# EAGLE design BusPirate-ultra-testboard.v1.0 (EAGLE 9.4.2)
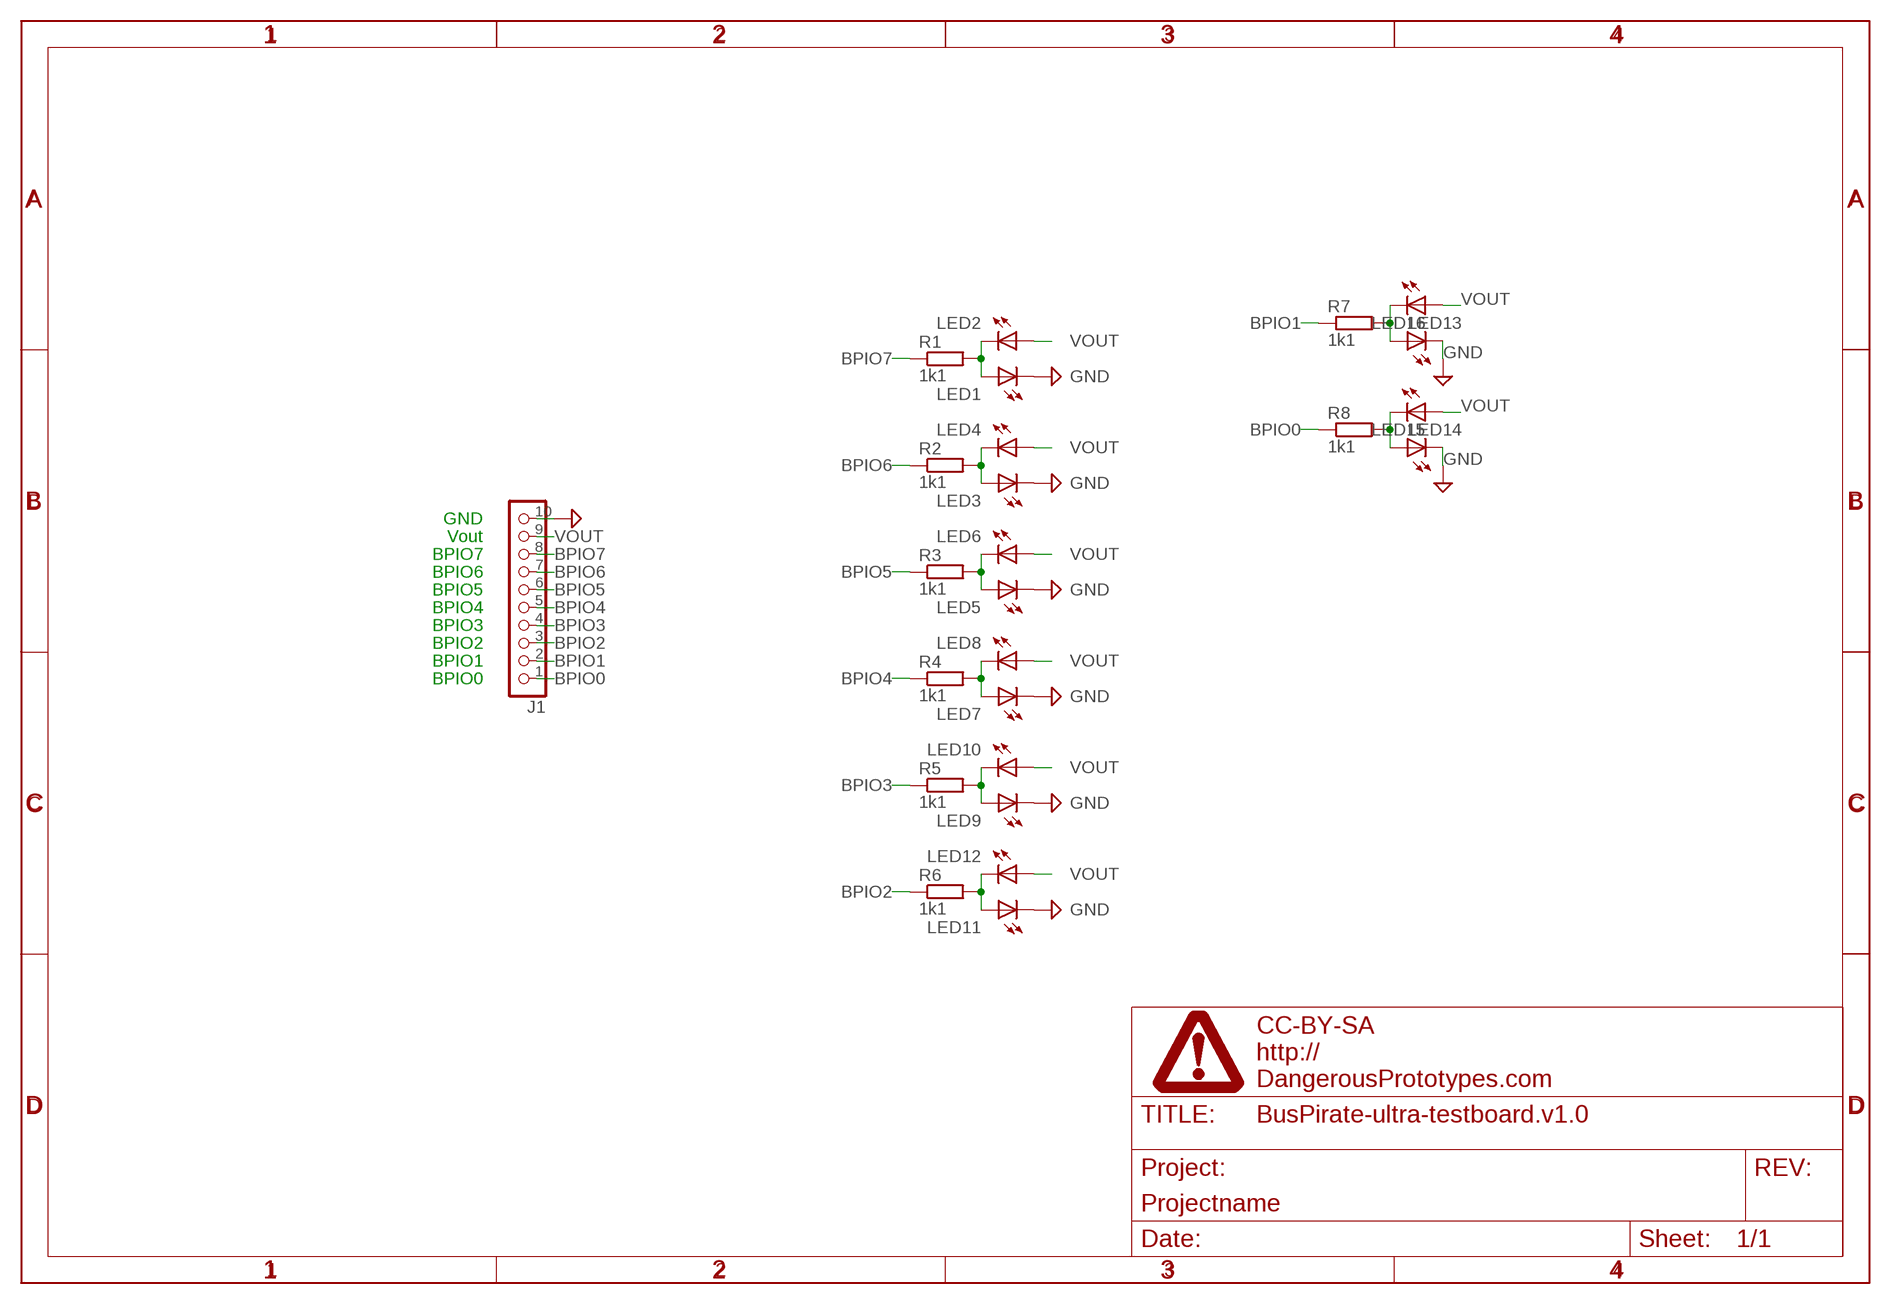
[diagram p0: schematic, sheet 1]

## Parts
J1  CON_HEADER_1X10-RIGHT_ANGLED_PTH  [M1X10_FEMALE_RIGHT_ANGLED_PTH]
LED1  LED-0805  [LED-805]
LED2  LED-0805  [LED-805]
LED3  LED-0805  [LED-805]
LED4  LED-0805  [LED-805]
LED5  LED-0805  [LED-805]
LED6  LED-0805  [LED-805]
LED7  LED-0805  [LED-805]
LED8  LED-0805  [LED-805]
LED9  LED-0805  [LED-805]
LED10  LED-0805  [LED-805]
LED11  LED-0805  [LED-805]
LED12  LED-0805  [LED-805]
LED13  LED-0805  [LED-805]
LED14  LED-0805  [LED-805]
LED15  LED-0805  [LED-805]
LED16  LED-0805  [LED-805]
PAGE1  FRAME_DINA4_L  [DP_LOGO]
R1  1k1  RESISTOR-0603  [R603]
R2  1k1  RESISTOR-0603  [R603]
R3  1k1  RESISTOR-0603  [R603]
R4  1k1  RESISTOR-0603  [R603]
R5  1k1  RESISTOR-0603  [R603]
R6  1k1  RESISTOR-0603  [R603]
R7  1k1  RESISTOR-0603  [R603]
R8  1k1  RESISTOR-0603  [R603]

## Nets
BPIO0: J1.1 R8.1
BPIO1: J1.2 R7.1
BPIO2: J1.3 R6.1
BPIO3: J1.4 R5.1
BPIO4: J1.5 R4.1
BPIO5: J1.6 R3.1
BPIO6: J1.7 R2.1
BPIO7: J1.8 R1.1
GND: J1.10 LED1.C LED3.C LED5.C LED7.C LED9.C LED11.C LED13.C LED14.C ; supply symbol labelled DGND
N$1: LED1.A LED2.C R1.2
N$2: LED3.A LED4.C R2.2
N$3: LED5.A LED6.C R3.2
N$4: LED7.A LED8.C R4.2
N$5: LED9.A LED10.C R5.2
N$6: LED11.A LED12.C R6.2
N$7: LED14.A LED15.C R8.2
N$8: LED13.A LED16.C R7.2
VOUT: J1.9 LED2.A LED4.A LED6.A LED8.A LED10.A LED12.A LED15.A LED16.A

## Notes on the sheet
- GND
- Vout
- BPIO7
- BPIO6
- BPIO5
- BPIO4
- BPIO3
- BPIO2
- BPIO1
- BPIO0

## Library data of the parts
J1 = dp_devices.v6:CON_HEADER_1X10
LED1-LED16 = dp_devices.v6:LED: Light Emitting Diode
PAGE1 = dp_devices.v6:FRAME_DINA4_L: A4 DP frame Standard Dangerous Prototypes schematic frame. Automagically adds the DP logo and standard texts to the PCB Use the atrribute in the schematic editor to change the fields.; FF1: fulfillment by; FF2: Seeed Studio; FF3: www.seeedstudio.com; LICENSE: CC-BY-SA; PROJECT: Projectname; URL1: http://; URL2: DangerousPrototypes.com
R1-R8 = dp_devices.v6:RESISTOR

## Board
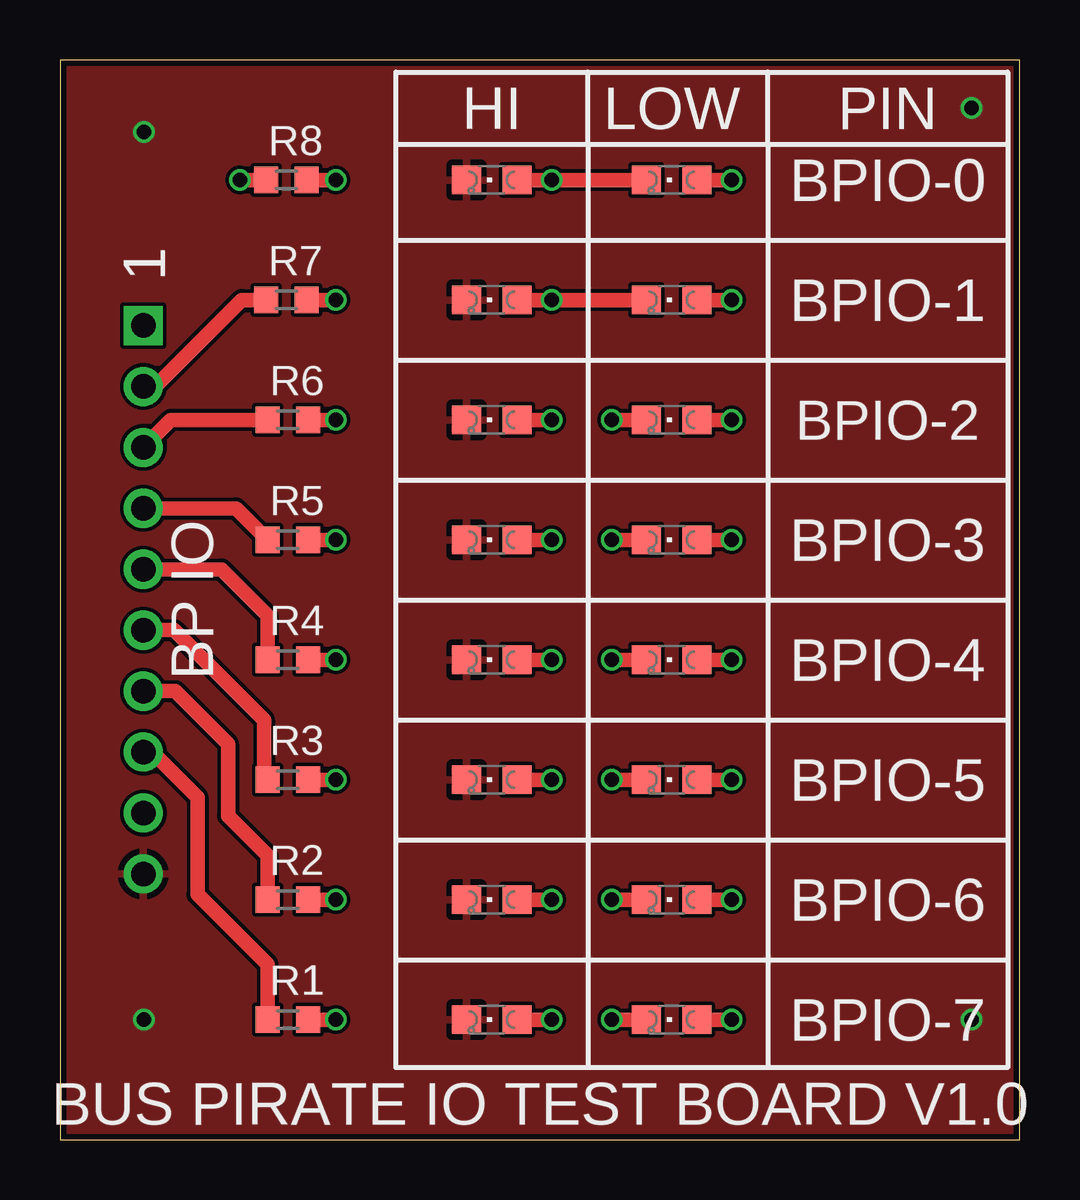
[diagram p1: board, top side]
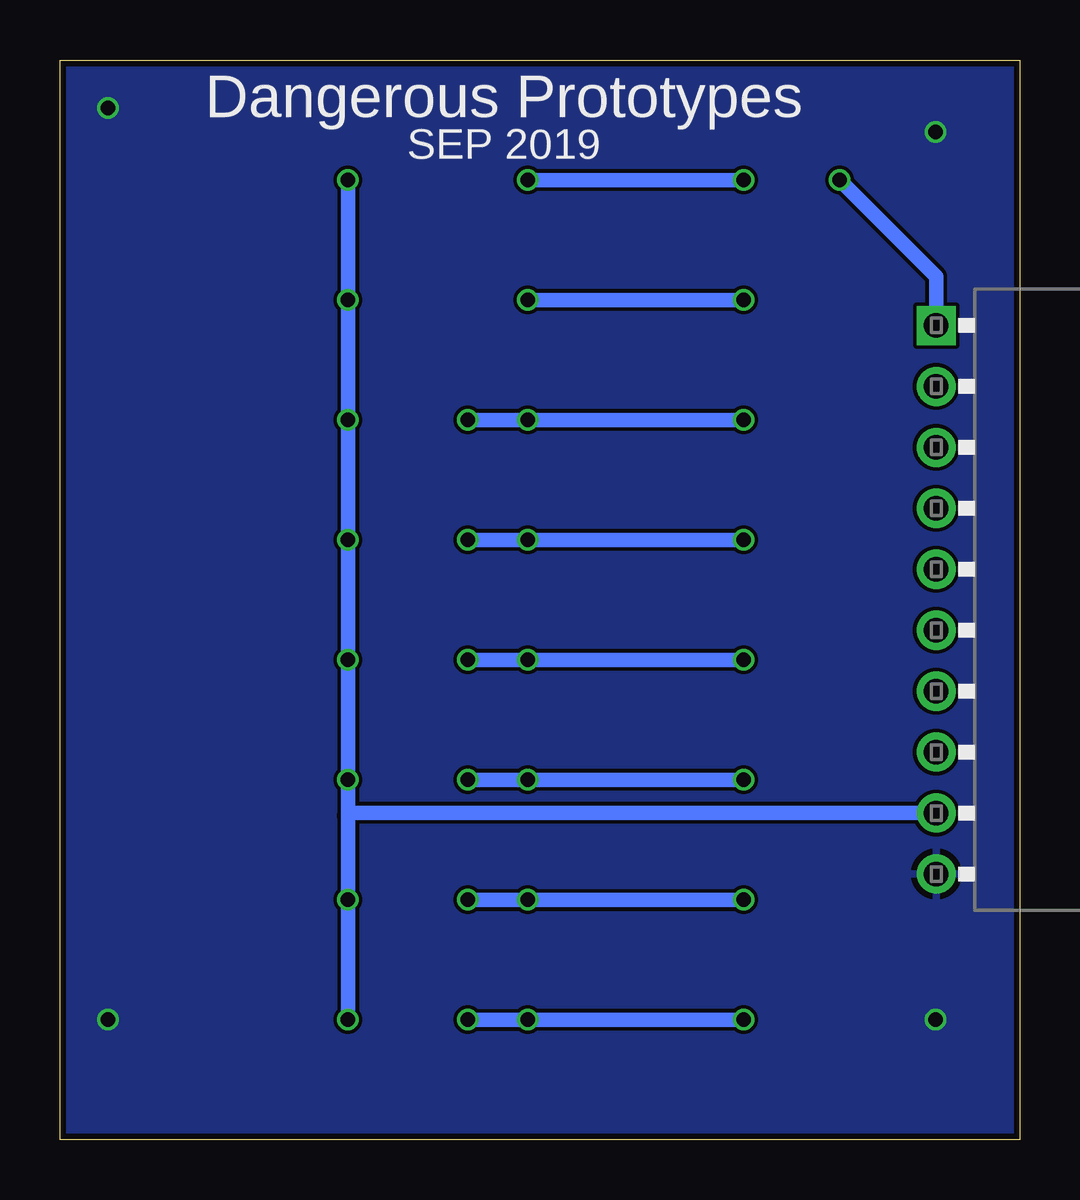
[diagram p2: board, bottom side, seen from below]

Size 40 x 45 mm. Coordinates in mm from the lower left corner, seen from the top.
Outline: 0,0 40,0 40,45 0,45 0,0
Copper layers (1*16): Top 0.035mm / dielectric 1.5mm / Bottom 0.035mm
Design rules "dirt_cheap_dirty_boards.v1.1": minimum track width 6mil, minimum drill 12mil, track to track 6mil, track to pad 6mil, pad to pad 6mil, via to via 6mil, smd to smd 0mil, copper to edge 10mil, drill to drill 10mil, minimum pad ring 10mil, minimum via ring 6mil, stop-mask expansion 2mil, vias tented up to drill 25mil, thermal gap 10mil

### Footprints (pad centres in the part's own frame; a part is rotated, then mirrored left to right if it is on the bottom)
M1X10_FEMALE_RIGHT_ANGLED_PTH = drill 1.02 pad 1.632 square: 1 -11.43,-5.85 | drill 1.02 pad 1.632: 2 -8.89,-5.85; 3 -6.35,-5.85; 4 -3.81,-5.85; 5 -1.27,-5.85; 6 1.27,-5.85; 7 3.81,-5.85; 8 6.35,-5.85; 9 8.89,-5.85; 10 11.43,-5.85
LED-805 = smd 1.2 x 1.2: A 0,-1.05; C 0,1.05
R603 = smd 1 x 1.1: 1 -0.85,0; 2 0.85,0

### Placement (x,y rotation side)
J1  -2.38,22.5 270 bottom
LED1  18,5 90 top
LED2  25.5,5 90 top
LED3  18,10 90 top
LED4  25.5,10 90 top
LED5  18,15 90 top
LED6  25.5,15 90 top
LED7  18,20 90 top
LED8  25.5,20 90 top
LED9  18,25 90 top
LED10  25.5,25 90 top
LED11  18,30 90 top
LED12  25.5,30 90 top
LED13  18,35 90 top
LED14  18,40 90 top
LED15  25.5,40 90 top
LED16  25.5,35 90 top
PAGE1  -30.48,16.51 0 top  (outside the outline)
R1  9.5,5 0 top
R2  9.5,10 0 top
R3  9.5,15 0 top
R4  9.5,20 0 top
R5  9.5,25 0 top
R6  9.5,30 0 top
R7  9.44,35 0 top
R8  9.44,40 0 top

### Tracks (layer width: path | path; a pad name or v marks a point on that pad's centre or on a via)
BPIO0  (via drill 0.58)
  Top 0.61: R8.1 v7.5,40
  Bottom 0.61: J1.1 3.47,35.97 6,38.5 v7.5,40
BPIO1
  Top 0.61: J1.2 3.97,31.39 7.58,35 R7.1
BPIO2
  Top 0.61: R6.1 4.62,30 J1.3
BPIO3
  Top 0.61: J1.4 7.34,26.31 R5.1
BPIO4
  Top 0.61: J1.5 6.73,23.77 8.65,21.85 R4.1
BPIO5
  Top 0.61: J1.6 4.77,21.23 8.5,17.5 8.5,15.15 R3.1
BPIO6
  Top 0.61: J1.7 4.81,18.69 7,16.5 7,13.5 8.65,11.85 R2.1
BPIO7
  Top 0.61: J1.8 3.85,16.15 5.74,14.26 5.74,10.21 8.65,7.3 R1.1
GND  (via drill 0.58)
  other vias: 3.5,42 3.5,5 38,5 38,43
  pour Top: 0,45 40,45 40,0 0,0
  pour Bottom: 0,45 40,45 40,0 0,0
N$1  (via drill 0.58)
  Top 0.61: R1.2 v11.5,5 | v20.5,5 LED1.A | LED2.C v23,5
  Bottom 0.61: v11.5,5 v20.5,5 v23,5
N$2  (via drill 0.58)
  Top 0.61: R2.2 v11.5,10 | LED4.C v23,10 | LED3.A v20.5,10
  Bottom 0.61: v23,10 v20.5,10 v11.5,10
N$3  (via drill 0.58)
  Top 0.61: R3.2 v11.5,15 | LED5.A v20.5,15 | LED6.C v23,15
  Bottom 0.61: v11.5,15 v20.5,15 v23,15
N$4  (via drill 0.58)
  Top 0.61: R4.2 v11.5,20 | LED7.A v20.5,20 | LED8.C v23,20
  Bottom 0.61: v11.5,20 v20.5,20 v23,20
N$5  (via drill 0.58)
  Top 0.61: R5.2 v11.5,25 | LED9.A v20.5,25 | LED10.C v23,25
  Bottom 0.61: v11.5,25 v20.5,25 v23,25
N$6  (via drill 0.58)
  Top 0.61: R6.2 v11.5,30 | LED11.A v20.5,30 | LED12.C v23,30
  Bottom 0.61: v11.5,30 v20.5,30 v23,30
N$7  (via drill 0.58)
  Top 0.61: R8.2 v11.5,40 | LED14.A v20.5,40 LED15.C
  Bottom 0.61: v11.5,40 v20.5,40
N$8  (via drill 0.58)
  Top 0.61: R7.2 v11.5,35 | LED13.A v20.5,35 LED16.C
  Bottom 0.61: v11.5,35 v20.5,35
VOUT  (via drill 0.58)
  Top 0.61: LED8.A v28,20 | LED10.A v28,25 | LED12.A v28,30 | LED16.A v28,35 | LED15.A v28,40 | LED4.A v28,10 | LED2.A v28,5 | LED6.A v28,15
  Bottom 0.61: v28,5 v28,10 28,13.5 | 28,13.5 v28,15 v28,20 v28,25 v28,30 v28,35 v28,40 | J1.9 27.89,13.61 28,13.5

### Text on the board
tPlace: HI | LOW | PIN | BPIO-0 | 1 | BPIO-1 | BPIO-2 | BPIO-3 | BP IO | BPIO-4 | BPIO-5 | BPIO-6 | BPIO-7 | BUS PIRATE IO TEST BOARD V1.0
bPlace: Dangerous Prototypes | SEP 2019